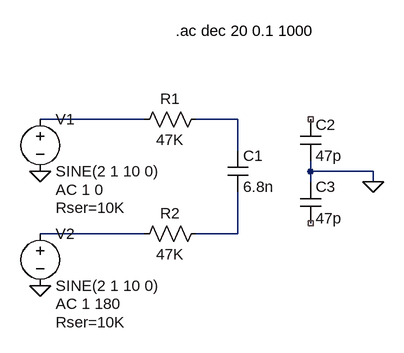
[diagram p0: schematic AFE Input.asc]
AFE Input.asc, the LTspice schematic file:
Version 4
SHEET 1 880 680
WIRE -16 64 -176 64
WIRE 128 64 64 64
WIRE 128 112 128 64
WIRE 240 144 240 128
WIRE 336 144 240 144
WIRE 240 160 240 144
WIRE 336 160 336 144
WIRE -16 240 -176 240
WIRE 128 240 128 176
WIRE 128 240 64 240
FLAG 336 160 0
FLAG -176 144 0
FLAG -176 320 0
SYMBOL res 80 48 R90
WINDOW 0 0 56 VBottom 2
WINDOW 3 32 56 VTop 2
SYMATTR InstName R1
SYMATTR Value 47K
SYMBOL res 80 224 R90
WINDOW 0 0 56 VBottom 2
WINDOW 3 32 56 VTop 2
SYMATTR InstName R2
SYMATTR Value 47K
SYMBOL cap 112 112 R0
SYMATTR InstName C1
SYMATTR Value 6.8n
SYMBOL cap 224 64 R0
SYMATTR InstName C2
SYMATTR Value 47p
SYMBOL cap 224 160 R0
SYMATTR InstName C3
SYMATTR Value 47p
SYMBOL voltage -176 48 R0
WINDOW 123 24 124 Left 2
WINDOW 39 24 152 Left 2
SYMATTR InstName V1
SYMATTR Value SINE(2 1 10 0)
SYMATTR Value2 AC 1 0
SYMATTR SpiceLine Rser=10K
SYMBOL voltage -176 224 R0
WINDOW 123 24 124 Left 2
WINDOW 39 24 152 Left 2
SYMATTR InstName V2
SYMATTR Value SINE(2 1 10 0)
SYMATTR Value2 AC 1 180
SYMATTR SpiceLine Rser=10K
TEXT 32 -72 Left 2 !.ac dec 20 0.1 1000

The netlist it stands for:
* AFE Input.asc
R1 N002 N001 47K
R2 N004 N003 47K
C1 N002 N004 6.8n
C2 NC_01 0 47p
C3 0 NC_02 47p
V1 N001 0 SINE(2 1 10 0) AC 1 0 Rser=10K
V2 N003 0 SINE(2 1 10 0) AC 1 180 Rser=10K
.ac dec 20 0.1 1000
.backanno
.end